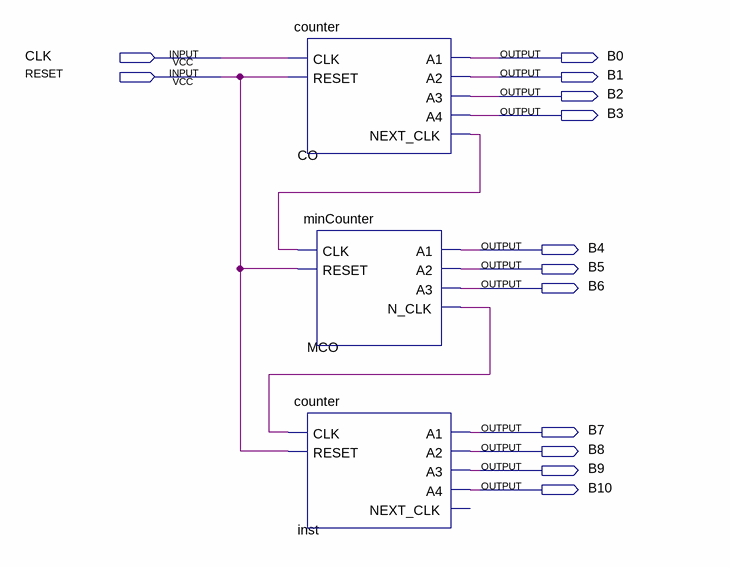
[diagram p0: schematic sheet]
// Quartus schematic playerclock.bdf as structural Verilog: 3 symbols, 13 pins
module playerclock (
  input  CLK,
  input  RESET,
  output B0,
  output B1,
  output B2,
  output B3,
  output B4,
  output B5,
  output B6,
  output B7,
  output B8,
  output B9,
  output B10
);

  wire CO_next_clk, MCO_n_clk;

  counter CO (.CLK(CLK), .RESET(RESET), .A1(B0), .A2(B1), .A3(B2), .A4(B3), .NEXT_CLK(CO_next_clk));
  minCounter MCO (.CLK(CO_next_clk), .RESET(RESET), .A1(B4), .A2(B5), .A3(B6), .N_CLK(MCO_n_clk));
  counter inst (.CLK(MCO_n_clk), .RESET(RESET), .A1(B7), .A2(B8), .A3(B9), .A4(B10));  // open: NEXT_CLK
endmodule
